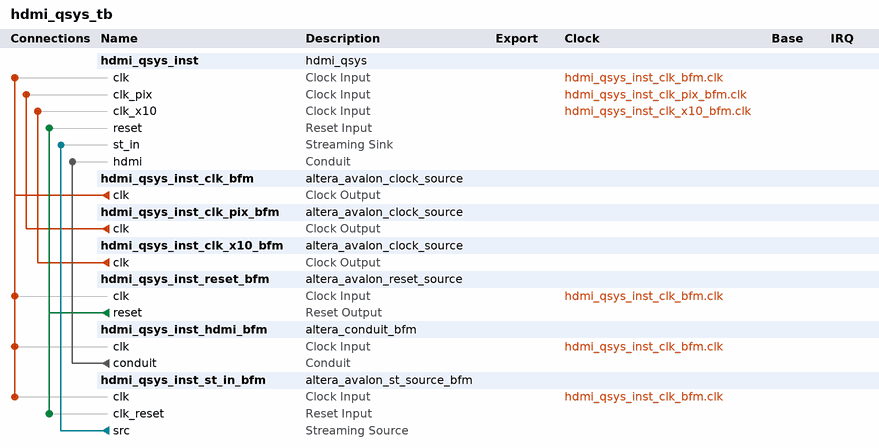
[diagram p0: system contents]
# Platform Designer (Qsys) system hdmi_qsys_tb, MAX 10 10M50SAE144C8G
# Parameters at their usual value, and those the tool derives, are not listed.
package require -exact qsys 18.0
create_system hdmi_qsys_tb
set_project_property DEVICE_FAMILY {MAX 10}
set_project_property DEVICE 10M50SAE144C8G

add_instance hdmi_qsys_inst hdmi_qsys 1.0

add_instance hdmi_qsys_inst_clk_bfm altera_avalon_clock_source 18.0
set_instance_parameter_value hdmi_qsys_inst_clk_bfm CLOCK_RATE 80000000

add_instance hdmi_qsys_inst_clk_pix_bfm altera_avalon_clock_source 18.0
set_instance_parameter_value hdmi_qsys_inst_clk_pix_bfm CLOCK_RATE 80000000

add_instance hdmi_qsys_inst_clk_x10_bfm altera_avalon_clock_source 18.0
set_instance_parameter_value hdmi_qsys_inst_clk_x10_bfm CLOCK_RATE 400000000

add_instance hdmi_qsys_inst_reset_bfm altera_avalon_reset_source 18.0
set_instance_parameter_value hdmi_qsys_inst_reset_bfm ASSERT_HIGH_RESET 1
set_instance_parameter_value hdmi_qsys_inst_reset_bfm INITIAL_RESET_CYCLES 50

add_instance hdmi_qsys_inst_hdmi_bfm altera_conduit_bfm 18.0
set_instance_parameter_value hdmi_qsys_inst_hdmi_bfm CLOCKED_SIGNAL true
set_instance_parameter_value hdmi_qsys_inst_hdmi_bfm ENABLE_RESET false
set_instance_parameter_value hdmi_qsys_inst_hdmi_bfm SIGNAL_DIRECTIONS input,input,input,input,input,input,input,input,input,input,input,input,input
set_instance_parameter_value hdmi_qsys_inst_hdmi_bfm SIGNAL_ROLES blue_n,blue_p,clk_pix_n,clk_pix_p,clk_st,green_n,green_p,horz,red_n,red_p,vert,x,y
set_instance_parameter_value hdmi_qsys_inst_hdmi_bfm SIGNAL_WIDTHS 1,1,1,1,1,1,1,11,1,1,11,11,11

add_instance hdmi_qsys_inst_st_in_bfm altera_avalon_st_source_bfm 18.0
set_instance_parameter_value hdmi_qsys_inst_st_in_bfm ST_CHANNEL_W 1
set_instance_parameter_value hdmi_qsys_inst_st_in_bfm ST_ERROR_W 1
set_instance_parameter_value hdmi_qsys_inst_st_in_bfm ST_MAX_CHANNELS 0
set_instance_parameter_value hdmi_qsys_inst_st_in_bfm ST_NUMSYMBOLS 1
set_instance_parameter_value hdmi_qsys_inst_st_in_bfm ST_SYMBOL_W 24
set_instance_parameter_value hdmi_qsys_inst_st_in_bfm USE_CHANNEL 0
set_instance_parameter_value hdmi_qsys_inst_st_in_bfm USE_EMPTY 0
set_instance_parameter_value hdmi_qsys_inst_st_in_bfm USE_ERROR 0
set_instance_parameter_value hdmi_qsys_inst_st_in_bfm USE_PACKET 0
set_instance_parameter_value hdmi_qsys_inst_st_in_bfm USE_READY 1
set_instance_parameter_value hdmi_qsys_inst_st_in_bfm USE_VALID 1

# connections
add_connection hdmi_qsys_inst_clk_bfm.clk hdmi_qsys_inst.clk clock
add_connection hdmi_qsys_inst_clk_bfm.clk hdmi_qsys_inst_hdmi_bfm.clk clock
add_connection hdmi_qsys_inst_clk_bfm.clk hdmi_qsys_inst_reset_bfm.clk clock
add_connection hdmi_qsys_inst_clk_bfm.clk hdmi_qsys_inst_st_in_bfm.clk clock
add_connection hdmi_qsys_inst_clk_pix_bfm.clk hdmi_qsys_inst.clk_pix clock
add_connection hdmi_qsys_inst_clk_x10_bfm.clk hdmi_qsys_inst.clk_x10 clock
add_connection hdmi_qsys_inst_reset_bfm.reset hdmi_qsys_inst.reset reset
add_connection hdmi_qsys_inst_reset_bfm.reset hdmi_qsys_inst_st_in_bfm.clk_reset reset
add_connection hdmi_qsys_inst_st_in_bfm.src hdmi_qsys_inst.st_in avalon_streaming
add_connection hdmi_qsys_inst_hdmi_bfm.conduit hdmi_qsys_inst.hdmi conduit

set_interconnect_requirement {$system} qsys_mm.clockCrossingAdapter HANDSHAKE
set_interconnect_requirement {$system} qsys_mm.enableEccProtection FALSE
set_interconnect_requirement {$system} qsys_mm.insertDefaultSlave FALSE
set_interconnect_requirement {$system} qsys_mm.maxAdditionalLatency 1

save_system hdmi_qsys_tb.qsys
